# Altium schematic sheet MCULeds.SchDoc
size A4
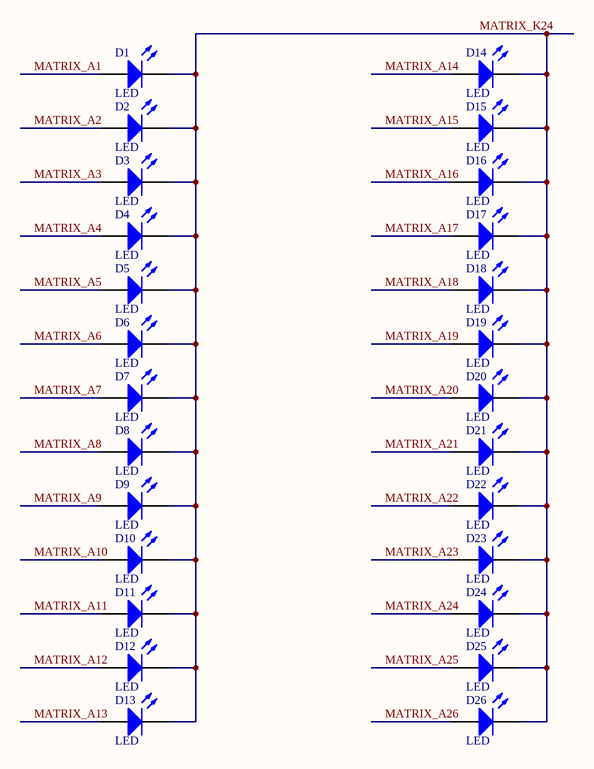
[diagram p0: MCULeds.SchDoc]

## Parts
D1  LED  [led_0402]
D2  LED  [led_0402]
D3  LED  [led_0402]
D4  LED  [led_0402]
D5  LED  [led_0402]
D6  LED  [led_0402]
D7  LED  [led_0402]
D8  LED  [led_0402]
D9  LED  [led_0402]
D10  LED  [led_0402]
D11  LED  [led_0402]
D12  LED  [led_0402]
D13  LED  [led_0402]
D14  LED  [led_0402]
D15  LED  [led_0402]
D16  LED  [led_0402]
D17  LED  [led_0402]
D18  LED  [led_0402]
D19  LED  [led_0402]
D20  LED  [led_0402]
D21  LED  [led_0402]
D22  LED  [led_0402]
D23  LED  [led_0402]
D24  LED  [led_0402]
D25  LED  [led_0402]
D26  LED  [led_0402]

## Nets
MATRIX_A1: D1.A
MATRIX_A2: D2.A
MATRIX_A3: D3.A
MATRIX_A4: D4.A
MATRIX_A5: D5.A
MATRIX_A6: D6.A
MATRIX_A7: D7.A
MATRIX_A8: D8.A
MATRIX_A9: D9.A
MATRIX_A10: D10.A
MATRIX_A11: D11.A
MATRIX_A12: D12.A
MATRIX_A13: D13.A
MATRIX_A14: D14.A
MATRIX_A15: D15.A
MATRIX_A16: D16.A
MATRIX_A17: D17.A
MATRIX_A18: D18.A
MATRIX_A19: D19.A
MATRIX_A20: D20.A
MATRIX_A21: D21.A
MATRIX_A22: D22.A
MATRIX_A23: D23.A
MATRIX_A24: D24.A
MATRIX_A25: D25.A
MATRIX_A26: D26.A
MATRIX_K24: D1.K D2.K D3.K D4.K D5.K D6.K D7.K D8.K D9.K D10.K D11.K D12.K D13.K D14.K D15.K D16.K D17.K D18.K D19.K D20.K D21.K D22.K D23.K D24.K D25.K D26.K

## Library data of the parts
D1-D26 = LED: Typical INFRARED GaAs LED; Published: 8-Jun-2000; LatestRevisionDate: 08-Jul-2005; LatestRevisionNote: Mech Layer 1 removed.; PackageReference: LED-0; Publisher: Altium Limited; PackageDescription: LED; 2 Leads